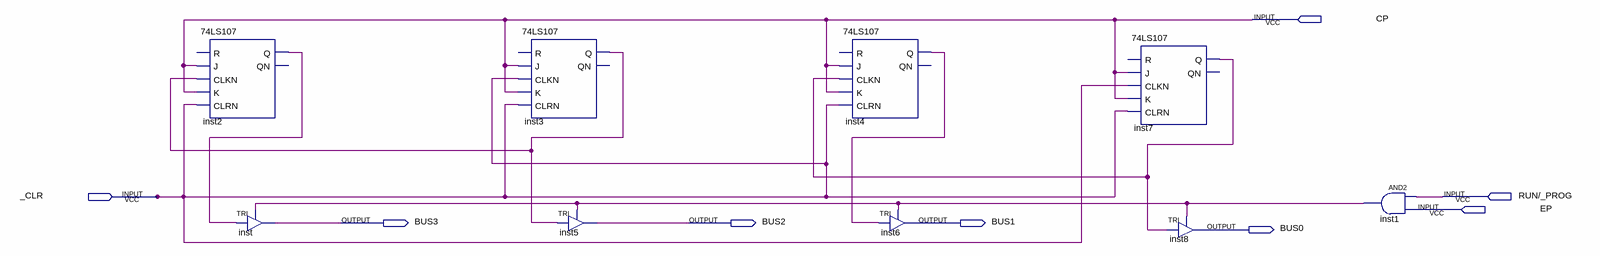
[diagram p0: schematic sheet]
// Quartus schematic ContadorDePrograma.bdf as structural Verilog: 9 symbols, 8 pins
module ContadorDePrograma (
  input  CP,
  input  _CLR,
  input  \RUN/_PROG ,
  input  EP,
  output BUS3,
  output BUS2,
  output BUS1,
  output BUS0
);

  wire inst1_out, inst2_q, inst3_q, inst4_q, inst7_q;

  \74LS107  inst2 (.J(CP), .CLKN(inst3_q), .K(CP), .CLRN(_CLR), .Q(inst2_q));  // open: R, QN
  TRI inst (.IN(inst2_q), .OE(inst1_out), .OUT(BUS3));
  \74LS107  inst3 (.J(CP), .CLKN(_CLR), .K(CP), .CLRN(_CLR), .Q(inst3_q));  // open: R, QN
  TRI inst5 (.IN(inst3_q), .OE(inst1_out), .OUT(BUS2));
  \74LS107  inst4 (.J(CP), .CLKN(inst7_q), .K(CP), .CLRN(_CLR), .Q(inst4_q));  // open: R, QN
  TRI inst6 (.IN(inst4_q), .OE(inst1_out), .OUT(BUS1));
  \74LS107  inst7 (.J(CP), .CLKN(_CLR), .K(CP), .CLRN(_CLR), .Q(inst7_q));  // open: R, QN
  TRI inst8 (.IN(inst7_q), .OE(inst1_out), .OUT(BUS0));
  and inst1 (inst1_out, \RUN/_PROG , EP);
endmodule
